# Altium schematic sheet USB_MINI_B.SchDoc
size A4; SheetNumber: 2; SheetTotal: 8
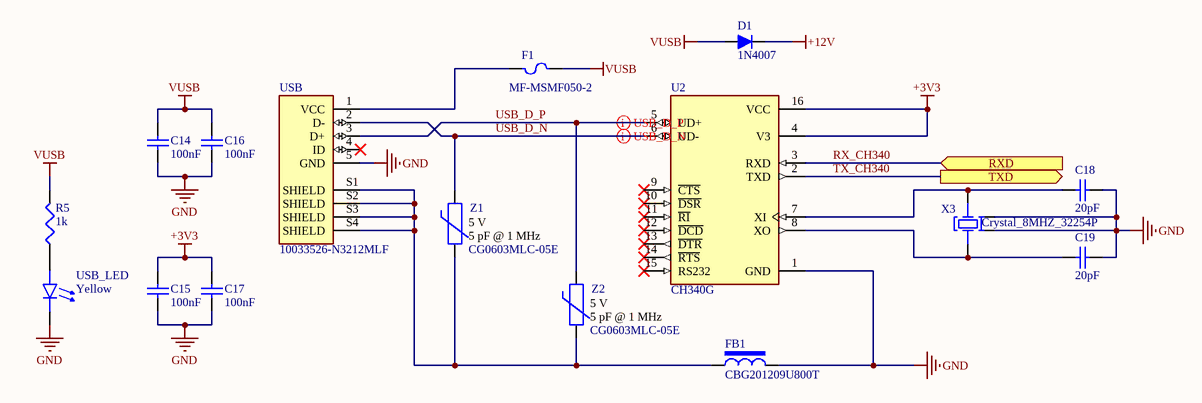
[diagram p0: USB_MINI_B.SchDoc]

## Parts
C14  100nF  [CAPC0805(2012)145_L]
C15  100nF  [CAPC0805(2012)145_L]
C16  100nF  [CAPC0805(2012)145_L]
C17  100nF  [CAPC0805(2012)145_L]
C18  value 20pF  [CAPC0805(2012)145_L]  (hidden comment: 22uF)
C19  value 20pF  [CAPC0805(2012)145_L]  (hidden comment: 22uF)
D1  1N4007  [1N4007]
F1  MF-MSMF050-2  [1812 (4532 Metric), Concave]
FB1  CBG201209U800T  [0805 (2012 Metric)]
R5  1k  [0805 (2012 Metric)]
U2  CH340G  [SOIC127P600X180-16N]
USB  10033526-N3212MLF  [AMPHENOL_10033526-N3212MLF]
USB_LED  Yellow  [0805 (2012 Metric) Yellow]
X3  Crystal_8MHZ_32254P  [4-SMD, No Lead (3.2mm x 2.5mm)]
Z1  Capacitance @ Frequency: 5 pF @ 1 MHz  Maximum DC Volts: 5 V  [0603 (1608 Metric)]  (hidden comment: CG0603MLC-05E)
Z2  Capacitance @ Frequency: 5 pF @ 1 MHz  Maximum DC Volts: 5 V  [0603 (1608 Metric)]  (hidden comment: CG0603MLC-05E)

## Ports
RXD (in), TXD (out)

## Nets
+3V3: C15.2 C17.2 U2.4(V3) U2.16(VCC)
+12V: D1.1
GND: C14.1 C15.1 C16.1 C17.1 C18.2 C19.2 FB1.2 U2.1(GND) USB.5(GND) USB_LED.1(K) X3.2(GND) X3.4(GND)
VUSB: C14.2 C16.2 D1.2 F1.2 R5.2
RX_CH340: U2.3(RXD) ; port RXD
TX_CH340: U2.2(TXD) ; port TXD
USB_D_N: U2.6(UD-) USB.2(D-) Z1.1
USB_D_P: U2.5(UD+) USB.3(D+) Z2.1
NetC18_1: C18.1 U2.7(XI) X3.3
NetC19_1: C19.1 U2.8(XO) X3.1
NetF1_1: F1.1 USB.1(VCC)
NetFB1_1: FB1.1 USB.S1(SHIELD) USB.S2(SHIELD) USB.S3(SHIELD) USB.S4(SHIELD) Z1.2 Z2.2
NetR5_1: R5.1 USB_LED.2(A)

Not connected (* = marked no-connect by the designer): U2 9(~{CTS})* 10(~{DSR})* 11(~{RI})* 12(~{DCD})* 13(~{DTR})* 14(~{RTS})* 15(RS232)*; USB 4(ID)*

## Layout directives
differential pair: USB_D_N, USB_D_P

## Library data of the parts
C14-C17 = CMP-001-00081-5: Chip Capacitor, 100nF +/-40%, 16V, 0805, Thickness 1.45 mm; Tolerance: 5%; Min Operating Temperature: -55°C; Case/Package: 0805; Pins: 2; Max Operating Temperature: 85°C; Voltage Rating: 16V; Mounting Technology: SMT; Value: 100nF
C18 C19 = CMP-001-00081-5: Chip Capacitor, 22µF +/-40%, 16V, 0805, Thickness 1.45 mm; Tolerance: 5%; Min Operating Temperature: -55°C; Case/Package: 0805; Pins: 2; Max Operating Temperature: 85°C; Voltage Rating: 16V; Mounting Technology: SMT
D1 = CMP-004-00031-1: Design Item ID: diode; Source: components.SchLib; JLCPCB Part #: C95872
F1 = CMP-006-000000-1: https://www.thegioiic.com/mf-msmf050-2-cau-chi-tu-phuc-hoi-1812-15v-0-5a; Voltage - Max: 15V; Current - Hold (Ih) (Max): 500 mA; Current - Trip (It): 1 A; Current - Max: 100 A; Time to Trip: 150 ms; Resistance - Initial (Ri) (Min): 150 mOhms; Resistance - Post Trip (R1) (Max): 1 Ohms; Part Number: MF-MSMF050-2; JLCPCB Part #: C17313; Design Item ID: CMP-005-00015-2; Pin Count: 2; Component Type: Fuses; Source: [CO2037] Power Consumption Calculator Arduino Board.SCHLIB
FB1 = CMP-005-00013-18: ComponentLink1Description: DigiKey; JLCPCB Part #: C139149; Source: components.SchLib; Design Item ID: CBG201209U800T
R5 = CMP-009-00179-13: Oreki; Value: 1k; ComponentLink1Description: DigiKey; RoHS Compliant: Yes; Mounting Technology: SMT; Pins: 2; Case/Package: Chip
U2 = CMP-012-000000-5: USB Interface Integrated Circuit; MF: WCH; Source: CH340G.SchLib; Availability: Not in stock; Component Type: Standard; Pin Count: 16; Price: None; Value: *; MP: Ch340G; Package: None; SnapEDA_Link: https://www.snapeda.com/parts/Ch340G/WCH/view-part/?ref=snap; Check_prices: https://www.snapeda.com/parts/Ch340G/WCH/view-part/?ref=eda; Design Item ID: CH340G
USB = CMP-037-000000-2: USB - mini B Receptacle Connector 5 Position Surface Mount, Right Angle; MF: Amphenol ICC; Value: *; Mouser-Purchase-URL: https://snapeda.com/shop?store=Mouser&id=47487; Package: None; Availability: Good; Component Type: Standard; MP: 10033526-N3212MLF; Source: 10033526-N3212MLF.SchLib; Price: None; Design Item ID: 10033526-N3212MLF; Pin Count: 9; Arrow_Electronics-Purchase-URL: https://snapeda.com/shop?store=Arrow+Electronics&id=47487; SnapEDA_Link: https://www.snapeda.com/parts/10033526-N3212MLF/Amphenol%20FCI/view-part/47487/?ref=snap; JLCPCB Part #: C2681563
USB_LED = CMP-007-00046-3: Oreki; JLCPCB Part #: C2296; ComponentLink1Description: DigiKey
X3 = CMP-003-00036-1: SMD3225-4P; ComponentLink1Description: DigiKey; JLCPCB Part #: C2682774
Z1 Z2 = CMP-009-000000-1: chua co link, xem tam: https://www.thegioiic.com/cg0603mlc-05e; Parameter 1: C840634; Energy: -; Part Number: CG0603MLC-05E; Design Item ID: CMP-001-00088-1; Source: [CO2037] Power Consumption Calculator Arduino Board.SCHLIB; Component Type: Capacitors; Pin Count: 2; JLCPCB Part #: C840634